# Altium schematic sheet FLUKE_USB_IR.SchDoc
size A4
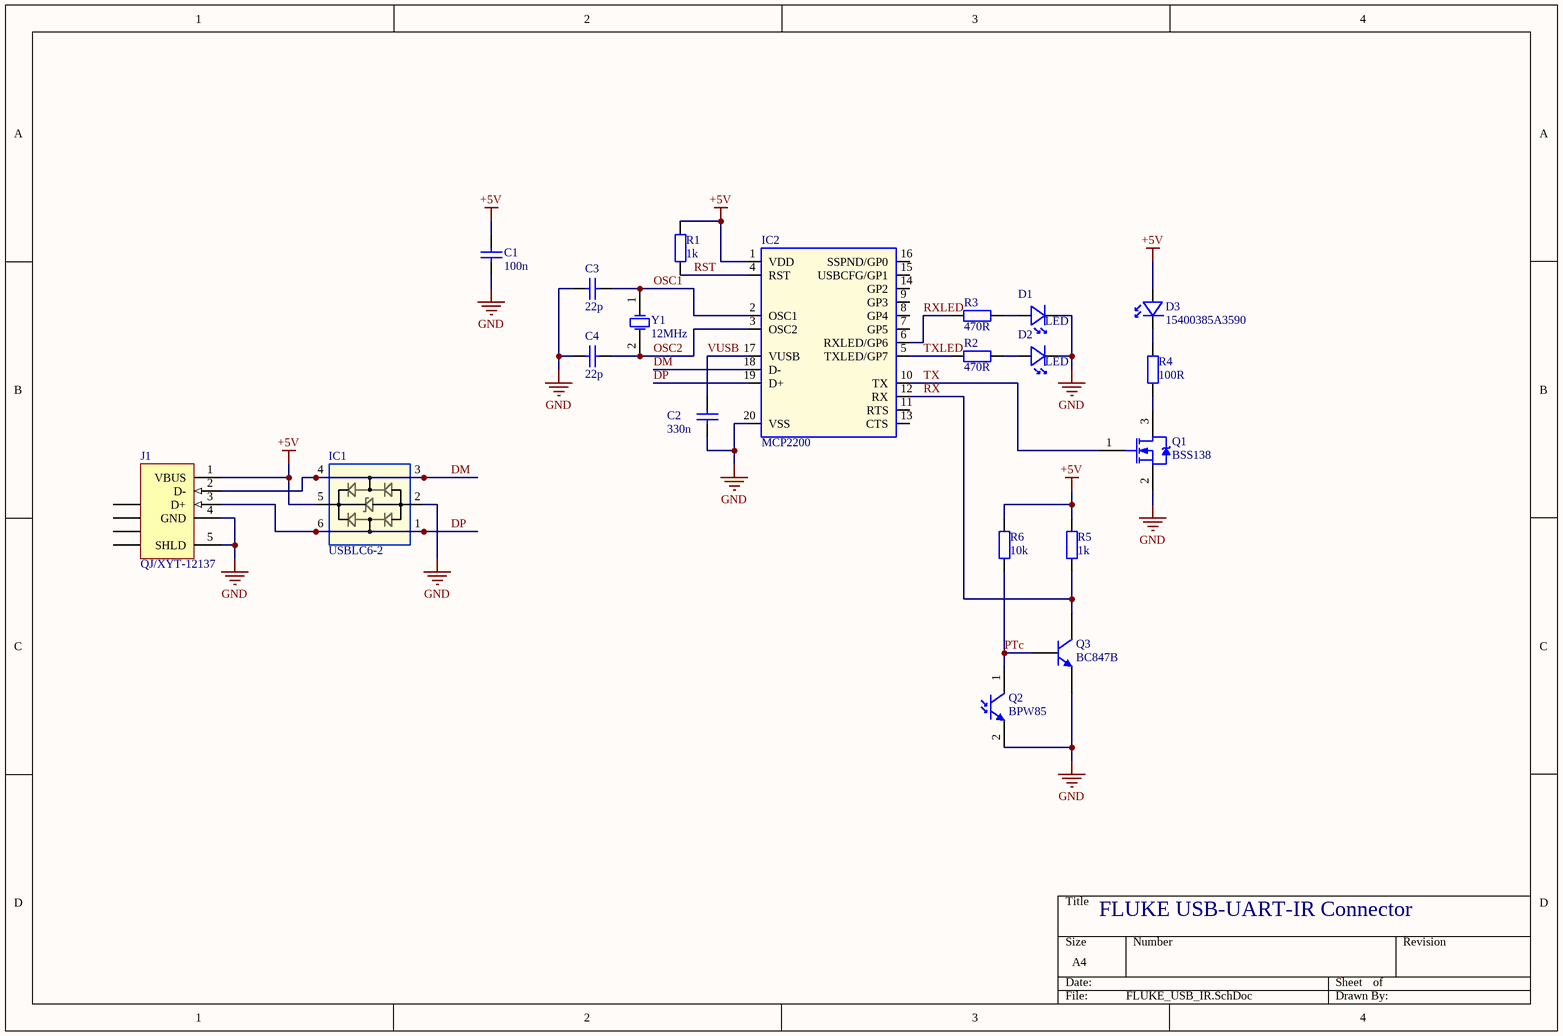
[diagram p0: FLUKE_USB_IR.SchDoc]

## Parts
C1  value 100n  [0603]  (hidden comment: Cap)
C2  value 330n  [0603]  (hidden comment: Cap)
C3  value 22p  [0603]  (hidden comment: Cap)
C4  value 22p  [0603]  (hidden comment: Cap)
D1  LED  [0805]
D2  LED  [0805]
D3  15400385A3590  [LED_3MM]
IC1  USBLC6-2  [SOT23-6]
IC2  MCP2200  [SOIC300-20_M]
J1  QJ/XYT-12137  [440247]
Q1  BSS138  [SOT23-3]
Q2  BPW85  [LED_3MM]
Q3  BC847B  [TO-236AB]
R1  value 1k  [0603]  (hidden comment: Res)
R2  value 470R  [0603]  (hidden comment: Res)
R3  value 470R  [0603]  (hidden comment: Res)
R4  value 100R  [0603]  (hidden comment: Res)
R5  value 1k  [0603]  (hidden comment: Res)
R6  value 10k  [0603]  (hidden comment: Res)
Y1  12MHz  [HC49/4H_SMX]

## Nets
+5V: C1.2 D3.1(A) IC1.5(VP) IC2.1(VDD) J1.1(VBUS) R1.2 R5.2 R6.2
GND: C1.1 C2.1 C3.2 C4.2 D1.2(K) D2.2(K) IC1.2(VN) IC2.20(VSS) J1.4(GND) J1.5(SHLD) Q1.2(S) Q2.2(E) Q3.3(E)
DM: IC1.3(IO) IC1.4(IO) IC2.18(D-) J1.2(D-)
DP: IC1.1(IO) IC1.6(IO) IC2.19(D+) J1.3(D+)
OSC1: C3.1 IC2.2(OSC1) Y1.1(OSC1)
OSC2: C4.1 IC2.3(OSC2) Y1.2(OSC2)
PTc: Q2.1(C) Q3.2(B) R6.1
RST: IC2.4(RST) R1.1
RX: IC2.12(RX) Q3.1(C) R5.1
RXLED: IC2.6(RXLED/GP6) R3.1
TX: IC2.10(TX) Q1.1(G)
TXLED: IC2.5(TXLED/GP7) R2.1
VUSB: C2.2 IC2.17(VUSB)
NetD1_1: D1.1(A) R3.2
NetD2_1: D2.1(A) R2.2
NetD3_2: D3.2(K) R4.2
NetQ1_3: Q1.3(D) R4.1

Not connected (* = marked no-connect by the designer): IC2 7(GP5) 8(GP4) 9(GP3) 11(RTS) 13(CTS) 14(GP2) 15(USBCFG/GP1) 16(SSPND/GP0); J1 6(SHLD) 7(SHLD) 8(SHLD) 9(SHLD)

## Notes on the sheet
- FLUKE USB-UART-IR Connector

## Library data of the parts
C1-C4 = Cap: Capacitor; Published: 8-Jun-2000; LatestRevisionDate: 17-Jul-2002; LatestRevisionNote: Re-released for DXP Platform.; PackageReference: RAD-0.3; Publisher: Altium Limited
D3 = LED
IC1 = USBLC6-2: Very low capacitance ESD protection diode array
IC2 = MCP2200: USB 2.0 to UART Protocol Converter with GPIO
J1 = 440247-1: USB 2.0, Right Angle, SMT, B Type, Receptacle, 5 Position, Black; ContactMaterial: Copper Alloy; ContactPlating: Gold (30); PCB_Layout: Complies with manufacturer's recommendation.; DrillSize: Corresponds to nominal value.; PanelGround: Without; Published: 15-Jul-2004; DatasheetDocument: 27-Jun-2003; PackageDocument: 27-Jun-2003; PackageReference: 440247; Publisher: Altium Limited; HousingMaterial: Thermoplastic; ComponentLink1Description: Manufacturer Link; ComponentLink1URL: http://www.tycoelectronics.com/; ComponentLink2Description: Packaging Specification; ComponentLink2URL: http://ecommas.tycoelectronics.com/commerce/DocumentDelivery/DDEController?Action=showdoc&DocId=Customer+Drawing%7F440247%7FD%7Fpdf%7FEnglish%7FC_440247_D.pdf
Q1 = BSS138: MOSFET SOT-23 N-CH LOGIC LEVEL; Published: 17-Sep-2003; DatasheetVersion: PD-9.486C; PackageReference: TO-254AA; Publisher: Altium Limited; PackageDescription: TO, Thru-Hole, Vertical, Heatsink Mounted; 3 In-Line Leads; Pitch 3.81 mm; Code_JEDEC: TO-254-AA; ComponentLink1Description: Manufacturer Link; ComponentLink1URL: http://www.irf.com/; ComponentLink2Description: Datasheet; ComponentLink2URL: http://www.irf.com/product-info/datasheets/data/IRFM460.pdf
Q2 = Phototransistor
Q3 = BC847A: Bipolar Pro Electron; PackageDocument: 1989; Published: 8-Jun-2000; LatestRevisionDate: 23-Sep-2002; LatestRevisionNote: Sim Model Pin Map changed.; DatasheetDocument: 1989; PackageReference: TO-236AB; Publisher: Altium Limited; Code_JEDEC: TO-236-AB; ComponentLink1Description: Manufacturer Link; ComponentLink1URL: http://www.national.com/
R1-R6 = Res: Resistor; Published: 8-Jun-2000; LatestRevisionDate: 17-Jul-2002; LatestRevisionNote: Re-released for DXP Platform.; PackageReference: AXIAL-0.4; Publisher: Altium Limited
Y1 = HC49/4H_SMX: Surface Mount Quartz Crystal; Note: PCB layout complies with manufacturer's recommendation.; Published: 17-Jul-2002; DatasheetDocument: 18-Oct-1999; PackageDocument: 18-Oct-1999; PackageReference: HC49/4H_SMX; Publisher: Altium Limited; ComponentLink1Description: Manufacturer Link; ComponentLink1URL: http://www.cmac.com/mt/; ComponentLink2Description: Datasheet; ComponentLink2URL: http://www.cmac.com/mt/databook/crystals/smd/hc49_4h_smx.pdf